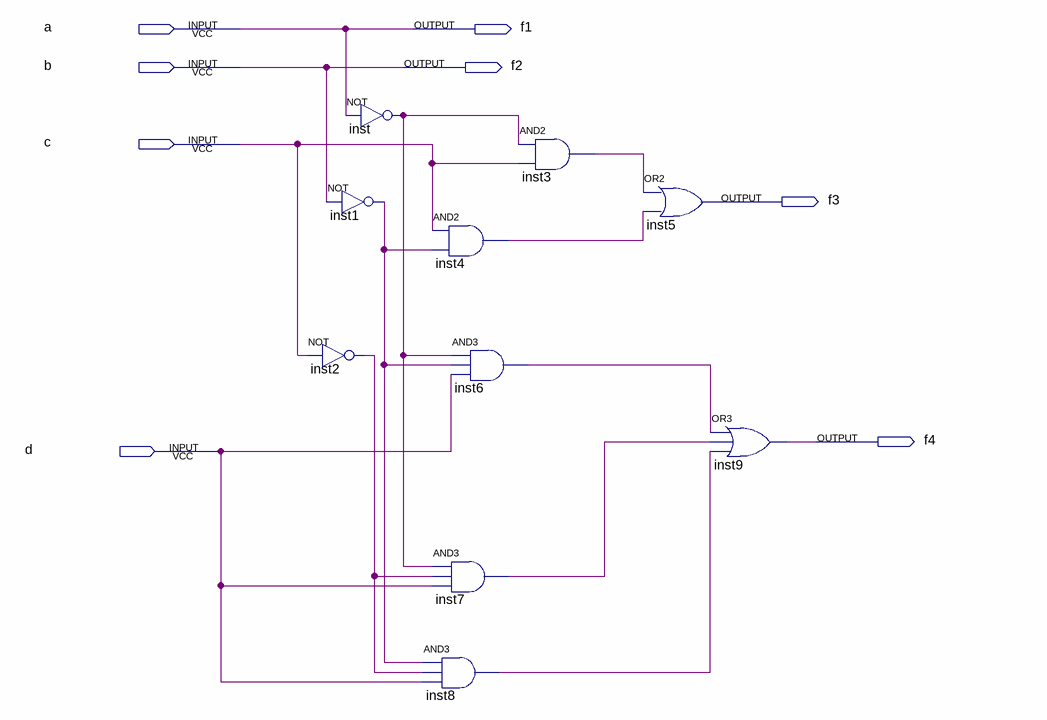
[diagram p0: schematic sheet]
// Quartus schematic exp1.bdf as structural Verilog: 10 symbols, 8 pins
module exp1 (
  input  a,
  input  b,
  input  c,
  input  d,
  output f1,
  output f2,
  output f3,
  output f4
);

  wire inst1_out, inst2_out, inst3_out, inst4_out, inst6_out, inst7_out, inst8_out, inst_out;

  not inst2 (inst2_out, c);
  not inst (inst_out, a);
  not inst1 (inst1_out, b);
  and inst4 (inst4_out, c, inst1_out);
  and inst6 (inst6_out, inst_out, inst1_out, d);
  and inst7 (inst7_out, inst_out, inst2_out, d);
  and inst8 (inst8_out, inst1_out, inst2_out, d);
  and inst3 (inst3_out, inst_out, c);
  or inst5 (f3, inst3_out, inst4_out);
  or inst9 (f4, inst6_out, inst7_out, inst8_out);

  assign f1 = a;
  assign f2 = b;
endmodule
